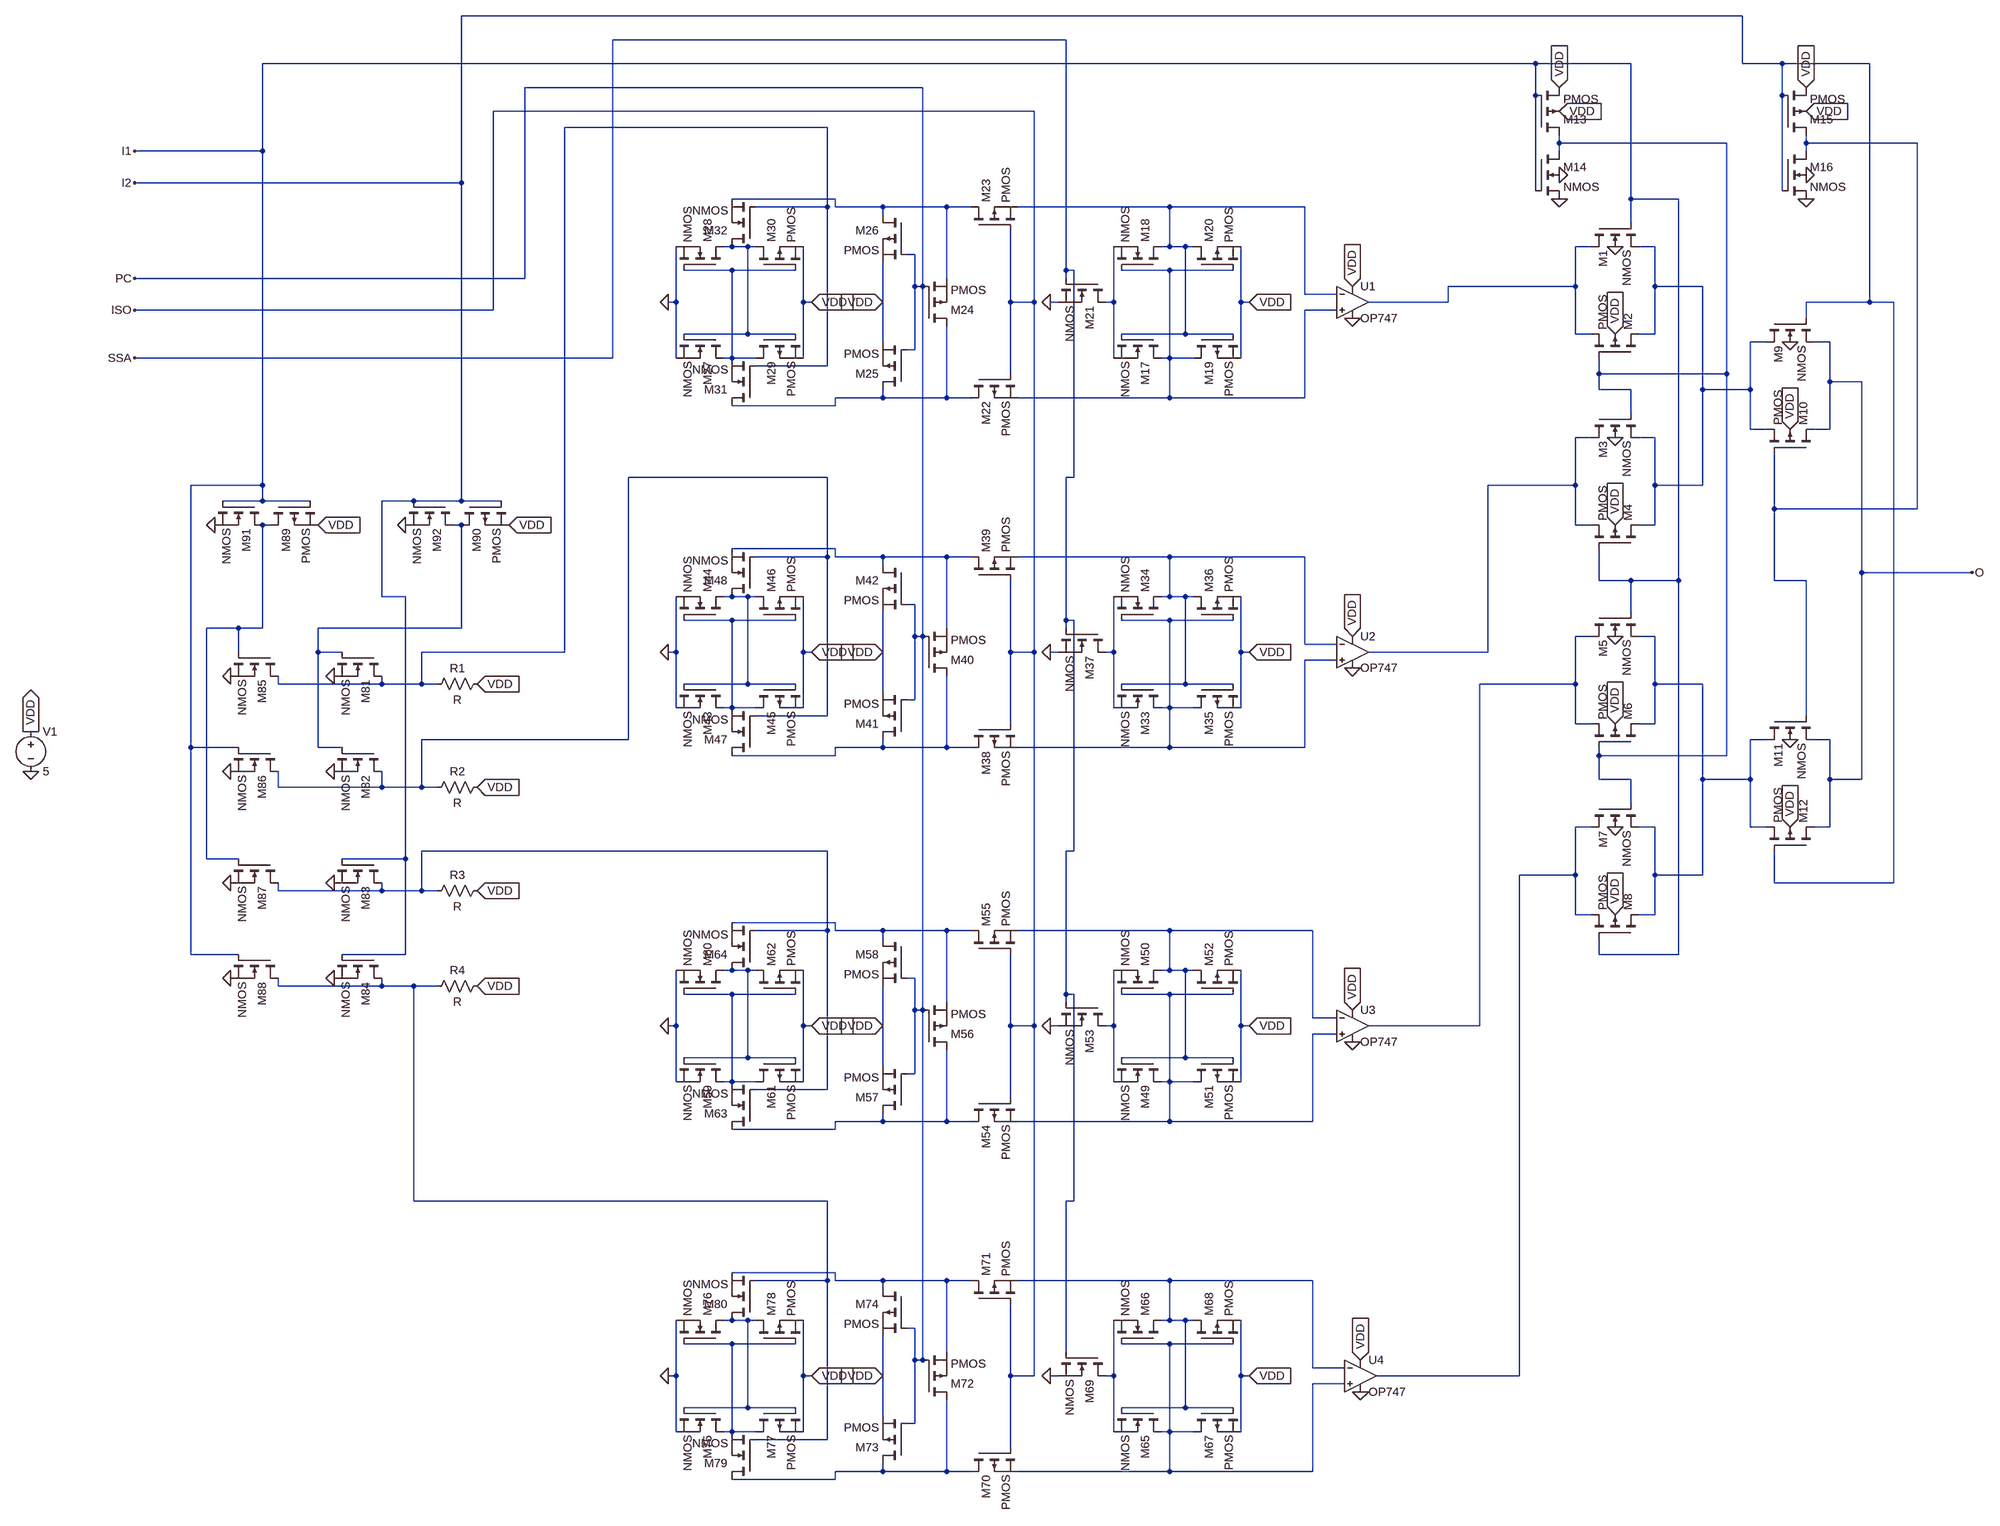
[diagram p0: schematic lut2.asc]
lut2.asc, the LTspice schematic file:
Version 4
SHEET 1 2856 2496
WIRE 768 -512 -1808 -512
WIRE -592 -464 -1504 -464
WIRE 352 -416 -2208 -416
WIRE 544 -416 352 -416
WIRE 768 -416 768 -512
WIRE 848 -416 768 -416
WIRE 1024 -416 848 -416
WIRE -880 -368 -1680 -368
WIRE 352 -352 352 -416
WIRE 848 -352 848 -416
WIRE -656 -320 -1744 -320
WIRE -1072 -288 -1600 -288
WIRE 400 -256 400 -272
WIRE 736 -256 400 -256
WIRE 896 -256 896 -272
WIRE 1120 -256 896 -256
WIRE -2208 -240 -2208 -416
WIRE -2208 -240 -2480 -240
WIRE 400 -240 400 -256
WIRE 896 -240 896 -256
WIRE -1808 -176 -1808 -512
WIRE -1808 -176 -2480 -176
WIRE 352 -160 352 -352
WIRE 848 -160 848 -352
WIRE -1056 -144 -1264 -144
WIRE 544 -144 544 -416
WIRE 640 -144 544 -144
WIRE -1072 -128 -1072 -288
WIRE -1072 -128 -1216 -128
WIRE -1056 -128 -1056 -144
WIRE -960 -128 -1056 -128
WIRE -832 -128 -960 -128
WIRE -784 -128 -832 -128
WIRE -384 -128 -688 -128
WIRE -112 -128 -384 -128
WIRE -960 -112 -960 -128
WIRE 544 -96 544 -144
WIRE -1264 -48 -1280 -48
WIRE -1232 -48 -1264 -48
WIRE -1216 -48 -1232 -48
WIRE -384 -48 -384 -128
WIRE -384 -48 -400 -48
WIRE -352 -48 -384 -48
WIRE -336 -48 -352 -48
WIRE 464 -48 432 -48
WIRE 592 -48 560 -48
WIRE -896 -32 -912 -32
WIRE -1264 0 -1360 0
WIRE -1136 0 -1264 0
WIRE -592 0 -592 -464
WIRE -576 0 -592 0
WIRE -384 0 -480 0
WIRE -256 0 -384 0
WIRE -1680 16 -1680 -368
WIRE -1680 16 -2480 16
WIRE -832 16 -832 -128
WIRE -592 16 -592 0
WIRE -896 32 -896 -32
WIRE -880 32 -880 -368
WIRE -880 32 -896 32
WIRE 432 32 432 -48
WIRE 432 32 176 32
WIRE 592 32 592 -48
WIRE 688 32 592 32
WIRE -112 48 -112 -128
WIRE -48 48 -112 48
WIRE -1376 64 -1376 -48
WIRE -1376 64 -1392 64
WIRE -1120 64 -1120 -48
WIRE -1104 64 -1120 64
WIRE -960 64 -960 -16
WIRE -704 64 -704 -80
WIRE -656 64 -656 -320
WIRE -656 64 -704 64
WIRE -608 64 -624 64
WIRE -496 64 -496 -48
WIRE -496 64 -512 64
WIRE -240 64 -240 -48
WIRE -224 64 -240 64
WIRE 176 64 176 32
WIRE 176 64 16 64
WIRE 1024 64 1024 -416
WIRE 1024 64 896 64
WIRE 1072 64 1024 64
WIRE -1744 80 -1744 -320
WIRE -1744 80 -2480 80
WIRE -48 80 -112 80
WIRE 896 96 896 64
WIRE -1232 128 -1232 -48
WIRE -1232 128 -1360 128
WIRE -1136 128 -1232 128
WIRE -352 128 -352 -48
WIRE -352 128 -480 128
WIRE -256 128 -352 128
WIRE 432 128 432 32
WIRE 464 128 432 128
WIRE 592 128 592 32
WIRE 592 128 560 128
WIRE -960 144 -960 64
WIRE 816 144 784 144
WIRE 944 144 912 144
WIRE -896 160 -896 32
WIRE -896 160 -912 160
WIRE -1504 176 -1504 -464
WIRE -1504 176 -2480 176
WIRE -1376 176 -1376 64
WIRE -1264 176 -1264 0
WIRE -1264 176 -1280 176
WIRE -1216 176 -1264 176
WIRE -1120 176 -1120 64
WIRE -496 176 -496 64
WIRE -384 176 -384 0
WIRE -384 176 -400 176
WIRE -336 176 -384 176
WIRE -240 176 -240 64
WIRE -1072 192 -1072 -128
WIRE -1072 192 -1216 192
WIRE -704 208 -704 64
WIRE 480 208 480 176
WIRE 736 208 736 -256
WIRE 736 208 480 208
WIRE 944 224 944 144
WIRE 1008 224 944 224
WIRE 480 240 480 208
WIRE 544 240 480 240
WIRE 688 240 688 32
WIRE 784 240 784 144
WIRE 784 240 688 240
WIRE -960 256 -960 240
WIRE -960 256 -1056 256
WIRE -832 256 -832 112
WIRE -832 256 -960 256
WIRE -784 256 -832 256
WIRE -384 256 -384 176
WIRE -384 256 -688 256
WIRE -112 256 -112 80
WIRE -112 256 -384 256
WIRE -1056 272 -1056 256
WIRE -1056 272 -1264 272
WIRE 544 288 544 240
WIRE 784 320 784 240
WIRE 816 320 784 320
WIRE 944 320 944 224
WIRE 944 320 912 320
WIRE 464 336 432 336
WIRE 592 336 560 336
WIRE -1072 416 -1472 416
WIRE -576 416 -576 0
WIRE -576 416 -592 416
WIRE -2208 432 -2208 -240
WIRE -2208 432 -2352 432
WIRE 432 432 432 336
WIRE 432 432 256 432
WIRE 592 432 592 336
WIRE 688 432 688 240
WIRE 688 432 592 432
WIRE -2208 464 -2208 432
WIRE -2208 464 -2288 464
WIRE -2112 464 -2208 464
WIRE -1904 464 -1968 464
WIRE -1808 464 -1808 -176
WIRE -1808 464 -1904 464
WIRE -1728 464 -1808 464
WIRE 832 480 832 368
WIRE 1120 480 1120 -256
WIRE 1120 480 832 480
WIRE -2192 512 -2208 512
WIRE -1808 512 -1824 512
WIRE 432 512 432 432
WIRE 464 512 432 512
WIRE 592 512 592 432
WIRE 592 512 560 512
WIRE -1056 560 -1264 560
WIRE -1072 576 -1072 416
WIRE -1072 576 -1216 576
WIRE -1056 576 -1056 560
WIRE -960 576 -1056 576
WIRE -832 576 -960 576
WIRE -784 576 -832 576
WIRE -384 576 -688 576
WIRE -112 576 -384 576
WIRE -960 592 -960 576
WIRE 1008 608 1008 224
WIRE 1248 608 1008 608
WIRE 480 624 480 560
WIRE 544 624 480 624
WIRE 640 624 640 -144
WIRE 640 624 544 624
WIRE 832 624 832 480
WIRE 896 624 832 624
WIRE -1968 656 -1968 464
WIRE -1920 656 -1968 656
WIRE -1264 656 -1280 656
WIRE -1232 656 -1264 656
WIRE -1216 656 -1232 656
WIRE -384 656 -384 576
WIRE -384 656 -400 656
WIRE -352 656 -384 656
WIRE -336 656 -352 656
WIRE -896 672 -912 672
WIRE 544 688 544 624
WIRE -1264 704 -1360 704
WIRE -1136 704 -1264 704
WIRE -592 704 -592 416
WIRE -576 704 -592 704
WIRE -384 704 -480 704
WIRE -256 704 -384 704
WIRE -2256 720 -2320 720
WIRE -2208 720 -2208 512
WIRE -2208 720 -2256 720
WIRE -1808 720 -1808 512
WIRE -1808 720 -2096 720
WIRE -832 720 -832 576
WIRE -592 720 -592 704
WIRE -896 736 -896 672
WIRE -880 736 -880 32
WIRE -880 736 -896 736
WIRE 464 736 432 736
WIRE 592 736 560 736
WIRE -112 752 -112 576
WIRE -48 752 -112 752
WIRE -2256 768 -2256 720
WIRE -2096 768 -2096 720
WIRE -2048 768 -2096 768
WIRE -1600 768 -1600 -288
WIRE -1600 768 -1888 768
WIRE -1376 768 -1376 656
WIRE -1376 768 -1392 768
WIRE -1120 768 -1120 656
WIRE -1104 768 -1120 768
WIRE -960 768 -960 688
WIRE -704 768 -704 624
WIRE -656 768 -656 64
WIRE -656 768 -704 768
WIRE -608 768 -624 768
WIRE -496 768 -496 656
WIRE -496 768 -512 768
WIRE -240 768 -240 656
WIRE -224 768 -240 768
WIRE 256 768 256 432
WIRE 256 768 16 768
WIRE -48 784 -112 784
WIRE -2176 832 -2176 816
WIRE -1968 832 -1968 816
WIRE -1968 832 -2176 832
WIRE -1888 832 -1888 768
WIRE -1888 832 -1968 832
WIRE -1856 832 -1888 832
WIRE -1232 832 -1232 656
WIRE -1232 832 -1360 832
WIRE -1136 832 -1232 832
WIRE -352 832 -352 656
WIRE -352 832 -480 832
WIRE -256 832 -352 832
WIRE 432 832 432 736
WIRE 432 832 240 832
WIRE 592 832 592 736
WIRE 688 832 592 832
WIRE -960 848 -960 768
WIRE -896 864 -896 736
WIRE -896 864 -912 864
WIRE -1376 880 -1376 768
WIRE -1264 880 -1264 704
WIRE -1264 880 -1280 880
WIRE -1216 880 -1264 880
WIRE -1120 880 -1120 768
WIRE -496 880 -496 768
WIRE -384 880 -384 704
WIRE -384 880 -400 880
WIRE -336 880 -384 880
WIRE -240 880 -240 768
WIRE -1072 896 -1072 576
WIRE -1072 896 -1216 896
WIRE 896 896 896 624
WIRE -704 912 -704 768
WIRE 432 912 432 832
WIRE 464 912 432 912
WIRE 592 912 592 832
WIRE 592 912 560 912
WIRE -1472 944 -1472 416
WIRE -1472 944 -1888 944
WIRE 816 944 784 944
WIRE 944 944 912 944
WIRE -2352 960 -2352 432
WIRE -2256 960 -2352 960
WIRE -2096 960 -2096 768
WIRE -2048 960 -2096 960
WIRE -960 960 -960 944
WIRE -960 960 -1056 960
WIRE -832 960 -832 816
WIRE -832 960 -960 960
WIRE -784 960 -832 960
WIRE -384 960 -384 880
WIRE -384 960 -688 960
WIRE -112 960 -112 784
WIRE -112 960 -384 960
WIRE -1056 976 -1056 960
WIRE -1056 976 -1264 976
WIRE 480 976 480 960
WIRE 736 976 736 208
WIRE 736 976 480 976
WIRE 480 1024 480 976
WIRE 544 1024 480 1024
WIRE 688 1024 688 832
WIRE 784 1024 784 944
WIRE 784 1024 688 1024
WIRE 944 1024 944 944
WIRE 1008 1024 1008 608
WIRE 1008 1024 944 1024
WIRE -2176 1040 -2176 1008
WIRE -1968 1040 -1968 1008
WIRE -1968 1040 -2176 1040
WIRE -1888 1040 -1888 944
WIRE -1888 1040 -1968 1040
WIRE -1856 1040 -1888 1040
WIRE 544 1072 544 1024
WIRE 464 1120 432 1120
WIRE 592 1120 560 1120
WIRE 784 1120 784 1024
WIRE 816 1120 784 1120
WIRE 944 1120 944 1024
WIRE 944 1120 912 1120
WIRE -1072 1168 -1888 1168
WIRE -576 1168 -576 704
WIRE -576 1168 -592 1168
WIRE -2320 1184 -2320 720
WIRE -2256 1184 -2320 1184
WIRE -1920 1184 -1920 656
WIRE -1920 1184 -2048 1184
WIRE 432 1216 432 1120
WIRE 432 1216 320 1216
WIRE 592 1216 592 1120
WIRE 688 1216 688 1024
WIRE 688 1216 592 1216
WIRE 832 1232 832 1168
WIRE 1072 1232 1072 64
WIRE 1072 1232 832 1232
WIRE -2176 1248 -2176 1232
WIRE -1968 1248 -1968 1232
WIRE -1968 1248 -2176 1248
WIRE -1888 1248 -1888 1168
WIRE -1888 1248 -1968 1248
WIRE -1856 1248 -1888 1248
WIRE 432 1296 432 1216
WIRE 464 1296 432 1296
WIRE 592 1296 592 1216
WIRE 592 1296 560 1296
WIRE -1056 1312 -1264 1312
WIRE -1072 1328 -1072 1168
WIRE -1072 1328 -1216 1328
WIRE -1056 1328 -1056 1312
WIRE -960 1328 -1056 1328
WIRE -832 1328 -960 1328
WIRE -784 1328 -832 1328
WIRE -384 1328 -688 1328
WIRE -96 1328 -384 1328
WIRE -960 1344 -960 1328
WIRE -2352 1376 -2352 960
WIRE -2256 1376 -2352 1376
WIRE -1920 1376 -1920 1184
WIRE -1920 1376 -2048 1376
WIRE 480 1376 480 1344
WIRE 640 1376 640 624
WIRE 640 1376 480 1376
WIRE -1264 1408 -1280 1408
WIRE -1232 1408 -1264 1408
WIRE -1216 1408 -1232 1408
WIRE -384 1408 -384 1328
WIRE -384 1408 -400 1408
WIRE -352 1408 -384 1408
WIRE -336 1408 -352 1408
WIRE -896 1424 -912 1424
WIRE -2176 1440 -2176 1424
WIRE -1968 1440 -1968 1424
WIRE -1968 1440 -2176 1440
WIRE -1904 1440 -1968 1440
WIRE -1856 1440 -1904 1440
WIRE -1264 1456 -1360 1456
WIRE -1136 1456 -1264 1456
WIRE -592 1456 -592 1168
WIRE -576 1456 -592 1456
WIRE -384 1456 -480 1456
WIRE -256 1456 -384 1456
WIRE -832 1472 -832 1328
WIRE -592 1472 -592 1456
WIRE -896 1488 -896 1424
WIRE -880 1488 -880 736
WIRE -880 1488 -896 1488
WIRE -96 1504 -96 1328
WIRE -48 1504 -96 1504
WIRE -1376 1520 -1376 1408
WIRE -1376 1520 -1392 1520
WIRE -1120 1520 -1120 1408
WIRE -1104 1520 -1120 1520
WIRE -960 1520 -960 1440
WIRE -704 1520 -704 1376
WIRE -656 1520 -656 768
WIRE -656 1520 -704 1520
WIRE -608 1520 -624 1520
WIRE -496 1520 -496 1408
WIRE -496 1520 -512 1520
WIRE -240 1520 -240 1408
WIRE -224 1520 -240 1520
WIRE 240 1520 240 832
WIRE 240 1520 16 1520
WIRE -48 1536 -96 1536
WIRE -1232 1584 -1232 1408
WIRE -1232 1584 -1360 1584
WIRE -1136 1584 -1232 1584
WIRE -352 1584 -352 1408
WIRE -352 1584 -480 1584
WIRE -256 1584 -352 1584
WIRE -960 1600 -960 1520
WIRE -896 1616 -896 1488
WIRE -896 1616 -912 1616
WIRE -1376 1632 -1376 1520
WIRE -1264 1632 -1264 1456
WIRE -1264 1632 -1280 1632
WIRE -1216 1632 -1264 1632
WIRE -1120 1632 -1120 1520
WIRE -496 1632 -496 1520
WIRE -384 1632 -384 1456
WIRE -384 1632 -400 1632
WIRE -336 1632 -384 1632
WIRE -240 1632 -240 1520
WIRE -1072 1648 -1072 1328
WIRE -1072 1648 -1216 1648
WIRE -704 1664 -704 1520
WIRE -960 1712 -960 1696
WIRE -960 1712 -1056 1712
WIRE -832 1712 -832 1568
WIRE -832 1712 -960 1712
WIRE -784 1712 -832 1712
WIRE -384 1712 -384 1632
WIRE -384 1712 -688 1712
WIRE -96 1712 -96 1536
WIRE -96 1712 -384 1712
WIRE -1056 1728 -1056 1712
WIRE -1056 1728 -1264 1728
WIRE -1904 1872 -1904 1440
WIRE -1072 1872 -1904 1872
WIRE -576 1872 -576 1456
WIRE -576 1872 -592 1872
WIRE -1056 2016 -1264 2016
WIRE -1072 2032 -1072 1872
WIRE -1072 2032 -1216 2032
WIRE -1056 2032 -1056 2016
WIRE -960 2032 -1056 2032
WIRE -832 2032 -960 2032
WIRE -784 2032 -832 2032
WIRE -384 2032 -688 2032
WIRE -96 2032 -384 2032
WIRE -960 2048 -960 2032
WIRE -1264 2112 -1280 2112
WIRE -1232 2112 -1264 2112
WIRE -1216 2112 -1232 2112
WIRE -384 2112 -384 2032
WIRE -384 2112 -400 2112
WIRE -352 2112 -384 2112
WIRE -336 2112 -352 2112
WIRE -896 2128 -912 2128
WIRE -1264 2160 -1360 2160
WIRE -1136 2160 -1264 2160
WIRE -384 2160 -480 2160
WIRE -256 2160 -384 2160
WIRE -832 2176 -832 2032
WIRE -592 2176 -592 1872
WIRE -896 2192 -896 2128
WIRE -880 2192 -880 1488
WIRE -880 2192 -896 2192
WIRE -96 2208 -96 2032
WIRE -32 2208 -96 2208
WIRE -1376 2224 -1376 2112
WIRE -1376 2224 -1392 2224
WIRE -1120 2224 -1120 2112
WIRE -1104 2224 -1120 2224
WIRE -960 2224 -960 2144
WIRE -704 2224 -704 2080
WIRE -656 2224 -656 1520
WIRE -656 2224 -704 2224
WIRE -608 2224 -624 2224
WIRE -496 2224 -496 2112
WIRE -496 2224 -512 2224
WIRE -240 2224 -240 2112
WIRE -224 2224 -240 2224
WIRE 320 2224 320 1216
WIRE 320 2224 32 2224
WIRE -32 2240 -96 2240
WIRE -1232 2288 -1232 2112
WIRE -1232 2288 -1360 2288
WIRE -1136 2288 -1232 2288
WIRE -352 2288 -352 2112
WIRE -352 2288 -480 2288
WIRE -256 2288 -352 2288
WIRE -960 2304 -960 2224
WIRE -896 2320 -896 2192
WIRE -896 2320 -912 2320
WIRE -1376 2336 -1376 2224
WIRE -1264 2336 -1264 2160
WIRE -1264 2336 -1280 2336
WIRE -1216 2336 -1264 2336
WIRE -1120 2336 -1120 2224
WIRE -496 2336 -496 2224
WIRE -384 2336 -384 2160
WIRE -384 2336 -400 2336
WIRE -336 2336 -384 2336
WIRE -240 2336 -240 2224
WIRE -1072 2352 -1072 2032
WIRE -1072 2352 -1216 2352
WIRE -704 2368 -704 2224
WIRE -960 2416 -960 2400
WIRE -960 2416 -1056 2416
WIRE -832 2416 -832 2272
WIRE -832 2416 -960 2416
WIRE -784 2416 -832 2416
WIRE -384 2416 -384 2336
WIRE -384 2416 -688 2416
WIRE -96 2416 -96 2240
WIRE -96 2416 -384 2416
WIRE -1056 2432 -1056 2416
WIRE -1056 2432 -1264 2432
FLAG 512 -48 0
FLAG 512 128 VDD
IOPIN 512 128 In
FLAG 512 336 0
FLAG 512 512 VDD
IOPIN 512 512 In
FLAG 512 736 0
FLAG 512 912 VDD
IOPIN 512 912 In
FLAG 512 1120 0
FLAG 512 1296 VDD
IOPIN 512 1296 In
FLAG 864 144 0
FLAG 864 320 VDD
IOPIN 864 320 In
FLAG 864 944 0
FLAG 864 1120 VDD
IOPIN 864 1120 In
FLAG 400 -368 VDD
IOPIN 400 -368 In
FLAG 400 -144 0
FLAG 896 -368 VDD
IOPIN 896 -368 In
FLAG 896 -144 0
FLAG 400 -320 VDD
IOPIN 400 -320 In
FLAG 896 -320 VDD
IOPIN 896 -320 In
FLAG 896 -192 0
FLAG 400 -192 0
FLAG -2992 1008 0
FLAG -2992 928 VDD
IOPIN -2992 928 Out
FLAG -224 64 VDD
IOPIN -224 64 In
FLAG -624 64 0
FLAG -960 64 VDD
IOPIN -960 64 In
FLAG -2480 176 SSA
FLAG -2480 80 ISO
FLAG -2480 16 PC
FLAG -1104 64 VDD
IOPIN -1104 64 In
FLAG -1392 64 0
FLAG -224 768 VDD
IOPIN -224 768 In
FLAG -624 768 0
FLAG -960 768 VDD
IOPIN -960 768 In
FLAG -1104 768 VDD
IOPIN -1104 768 In
FLAG -1392 768 0
FLAG -224 1520 VDD
IOPIN -224 1520 In
FLAG -624 1520 0
FLAG -960 1520 VDD
IOPIN -960 1520 In
FLAG -1104 1520 VDD
IOPIN -1104 1520 In
FLAG -1392 1520 0
FLAG -224 2224 VDD
IOPIN -224 2224 In
FLAG -624 2224 0
FLAG -960 2224 VDD
IOPIN -960 2224 In
FLAG -1104 2224 VDD
IOPIN -1104 2224 In
FLAG -1392 2224 0
FLAG 0 2192 VDD
IOPIN 0 2192 In
FLAG 0 2256 0
FLAG -16 1488 VDD
IOPIN -16 1488 In
FLAG -16 1552 0
FLAG -16 736 VDD
IOPIN -16 736 In
FLAG -16 800 0
FLAG -16 32 VDD
IOPIN -16 32 In
FLAG -16 96 0
FLAG -2064 816 0
FLAG -2064 1008 0
FLAG -2064 1232 0
FLAG -2064 1424 0
FLAG -2272 1424 0
FLAG -2272 1232 0
FLAG -2272 1008 0
FLAG -2272 816 0
FLAG -1776 832 VDD
IOPIN -1776 832 In
FLAG -1776 1040 VDD
IOPIN -1776 1040 In
FLAG -1776 1248 VDD
IOPIN -1776 1248 In
FLAG -1776 1440 VDD
IOPIN -1776 1440 In
FLAG -2096 512 VDD
IOPIN -2096 512 In
FLAG -1712 512 VDD
IOPIN -1712 512 In
FLAG -2304 512 0
FLAG -1920 512 0
FLAG -2480 -240 I1
FLAG -2480 -176 I2
FLAG 1248 608 O
SYMBOL nmos4 464 -96 M90
WINDOW 0 56 25 Left 2
SYMATTR InstName M1
SYMBOL pmos4 560 176 M270
WINDOW 0 56 21 Left 2
SYMATTR InstName M2
SYMBOL nmos4 464 288 M90
WINDOW 0 56 25 Left 2
SYMATTR InstName M3
SYMBOL pmos4 560 560 M270
WINDOW 0 56 21 Left 2
SYMATTR InstName M4
SYMBOL nmos4 464 688 M90
WINDOW 0 56 25 Left 2
SYMATTR InstName M5
SYMBOL pmos4 560 960 M270
WINDOW 0 56 21 Left 2
SYMATTR InstName M6
SYMBOL nmos4 464 1072 M90
WINDOW 0 56 25 Left 2
SYMATTR InstName M7
SYMBOL pmos4 560 1344 M270
WINDOW 0 56 21 Left 2
SYMATTR InstName M8
SYMBOL nmos4 816 96 M90
WINDOW 0 56 25 Left 2
SYMATTR InstName M9
SYMBOL pmos4 912 368 M270
WINDOW 0 56 21 Left 2
SYMATTR InstName M10
SYMBOL nmos4 816 896 M90
WINDOW 0 56 25 Left 2
SYMATTR InstName M11
SYMBOL pmos4 912 1168 M270
WINDOW 0 56 21 Left 2
SYMATTR InstName M12
SYMBOL pmos4 352 -272 M180
SYMATTR InstName M13
SYMBOL nmos4 352 -240 R0
SYMATTR InstName M14
SYMBOL pmos4 848 -272 M180
SYMATTR InstName M15
SYMBOL nmos4 848 -240 R0
SYMATTR InstName M16
SYMBOL voltage -2992 912 R0
WINDOW 123 0 0 Left 0
WINDOW 39 0 0 Left 0
SYMATTR InstName V1
SYMATTR Value 5
SYMBOL nmos -400 128 R90
SYMATTR InstName M17
SYMBOL nmos -400 0 M270
SYMATTR InstName M18
SYMBOL pmos -336 128 M90
SYMATTR InstName M19
SYMBOL pmos -336 0 R270
SYMATTR InstName M20
SYMBOL nmos -512 16 R90
SYMATTR InstName M21
SYMBOL pmos -784 208 M90
SYMATTR InstName M22
SYMBOL pmos -784 -80 R270
SYMATTR InstName M23
SYMBOL pmos -880 112 M180
SYMATTR InstName M24
SYMBOL pmos -912 240 R180
SYMATTR InstName M25
SYMBOL pmos -912 -112 M0
SYMATTR InstName M26
SYMBOL nmos -1280 128 R90
SYMATTR InstName M27
SYMBOL nmos -1280 0 M270
SYMATTR InstName M28
SYMBOL pmos -1216 128 M90
SYMATTR InstName M29
SYMBOL pmos -1216 0 R270
SYMATTR InstName M30
SYMBOL nmos -1216 272 R180
SYMATTR InstName M31
SYMBOL nmos -1216 -48 R180
SYMATTR InstName M32
SYMBOL nmos -400 832 R90
SYMATTR InstName M33
SYMBOL nmos -400 704 M270
SYMATTR InstName M34
SYMBOL pmos -336 832 M90
SYMATTR InstName M35
SYMBOL pmos -336 704 R270
SYMATTR InstName M36
SYMBOL nmos -512 720 R90
SYMATTR InstName M37
SYMBOL pmos -784 912 M90
SYMATTR InstName M38
SYMBOL pmos -784 624 R270
SYMATTR InstName M39
SYMBOL pmos -880 816 M180
SYMATTR InstName M40
SYMBOL pmos -912 944 R180
SYMATTR InstName M41
SYMBOL pmos -912 592 M0
SYMATTR InstName M42
SYMBOL nmos -1280 832 R90
SYMATTR InstName M43
SYMBOL nmos -1280 704 M270
SYMATTR InstName M44
SYMBOL pmos -1216 832 M90
SYMATTR InstName M45
SYMBOL pmos -1216 704 R270
SYMATTR InstName M46
SYMBOL nmos -1216 976 R180
SYMATTR InstName M47
SYMBOL nmos -1216 656 R180
SYMATTR InstName M48
SYMBOL nmos -400 1584 R90
SYMATTR InstName M49
SYMBOL nmos -400 1456 M270
SYMATTR InstName M50
SYMBOL pmos -336 1584 M90
SYMATTR InstName M51
SYMBOL pmos -336 1456 R270
SYMATTR InstName M52
SYMBOL nmos -512 1472 R90
SYMATTR InstName M53
SYMBOL pmos -784 1664 M90
SYMATTR InstName M54
SYMBOL pmos -784 1376 R270
SYMATTR InstName M55
SYMBOL pmos -880 1568 M180
SYMATTR InstName M56
SYMBOL pmos -912 1696 R180
SYMATTR InstName M57
SYMBOL pmos -912 1344 M0
SYMATTR InstName M58
SYMBOL nmos -1280 1584 R90
SYMATTR InstName M59
SYMBOL nmos -1280 1456 M270
SYMATTR InstName M60
SYMBOL pmos -1216 1584 M90
SYMATTR InstName M61
SYMBOL pmos -1216 1456 R270
SYMATTR InstName M62
SYMBOL nmos -1216 1728 R180
SYMATTR InstName M63
SYMBOL nmos -1216 1408 R180
SYMATTR InstName M64
SYMBOL nmos -400 2288 R90
SYMATTR InstName M65
SYMBOL nmos -400 2160 M270
SYMATTR InstName M66
SYMBOL pmos -336 2288 M90
SYMATTR InstName M67
SYMBOL pmos -336 2160 R270
SYMATTR InstName M68
SYMBOL nmos -512 2176 R90
SYMATTR InstName M69
SYMBOL pmos -784 2368 M90
SYMATTR InstName M70
SYMBOL pmos -784 2080 R270
SYMATTR InstName M71
SYMBOL pmos -880 2272 M180
SYMATTR InstName M72
SYMBOL pmos -912 2400 R180
SYMATTR InstName M73
SYMBOL pmos -912 2048 M0
SYMATTR InstName M74
SYMBOL nmos -1280 2288 R90
SYMATTR InstName M75
SYMBOL nmos -1280 2160 M270
SYMATTR InstName M76
SYMBOL pmos -1216 2288 M90
SYMATTR InstName M77
SYMBOL pmos -1216 2160 R270
SYMATTR InstName M78
SYMBOL nmos -1216 2432 R180
SYMATTR InstName M79
SYMBOL nmos -1216 2112 R180
SYMATTR InstName M80
SYMBOL OpAmps\\OP747 -16 0 R0
SYMATTR InstName U1
SYMBOL OpAmps\\OP747 -16 704 R0
SYMATTR InstName U2
SYMBOL OpAmps\\OP747 -16 1456 R0
SYMATTR InstName U3
SYMBOL OpAmps\\OP747 0 2160 R0
SYMATTR InstName U4
SYMBOL nmos -1968 768 R90
SYMATTR InstName M81
SYMBOL nmos -1968 960 R90
SYMATTR InstName M82
SYMBOL res -1760 816 R90
WINDOW 0 0 56 VBottom 2
WINDOW 3 32 56 VTop 2
SYMATTR InstName R1
SYMBOL res -1760 1024 R90
WINDOW 0 0 56 VBottom 2
WINDOW 3 32 56 VTop 2
SYMATTR InstName R2
SYMBOL res -1760 1232 R90
WINDOW 0 0 56 VBottom 2
WINDOW 3 32 56 VTop 2
SYMATTR InstName R3
SYMBOL res -1760 1424 R90
WINDOW 0 0 56 VBottom 2
WINDOW 3 32 56 VTop 2
SYMATTR InstName R4
SYMBOL nmos -1968 1184 R90
SYMATTR InstName M83
SYMBOL nmos -1968 1376 R90
SYMATTR InstName M84
SYMBOL nmos -2176 768 R90
SYMATTR InstName M85
SYMBOL nmos -2176 960 R90
SYMATTR InstName M86
SYMBOL nmos -2176 1184 R90
SYMATTR InstName M87
SYMBOL nmos -2176 1376 R90
SYMATTR InstName M88
SYMBOL pmos -2192 464 M90
SYMATTR InstName M89
SYMBOL pmos -1808 464 M90
SYMATTR InstName M90
SYMBOL nmos -2208 464 R90
SYMATTR InstName M91
SYMBOL nmos -1824 464 R90
SYMATTR InstName M92

The netlist it stands for:
* lut2.asc
M1 N007 I1 N008 0 NMOS
M2 N008 N002 N007 VDD PMOS
M3 N013 N002 N008 0 NMOS
M4 N008 I1 N013 VDD PMOS
M5 N022 I1 N023 0 NMOS
M6 N023 N002 N022 VDD PMOS
M7 N026 N002 N023 0 NMOS
M8 N023 I1 N026 VDD PMOS
M9 N008 I2 O 0 NMOS
M10 O N003 N008 VDD PMOS
M11 N023 N003 O 0 NMOS
M12 O I2 N023 VDD PMOS
M13 N002 I1 VDD VDD PMOS
M14 N002 I1 0 0 NMOS
M15 N003 I2 VDD VDD PMOS
M16 N003 I2 0 0 NMOS
V1 VDD 0 5
M17 N010 N005 N011 N011 NMOS
M18 N005 N010 N011 N011 NMOS
M19 N010 N005 VDD VDD PMOS
M20 N005 N010 VDD VDD PMOS
M21 N011 SSA 0 0 NMOS
M22 N012 ISO N010 N010 PMOS
M23 N004 ISO N005 N005 PMOS
M24 N012 PC N004 N004 PMOS
M25 N012 PC VDD VDD PMOS
M26 N004 PC VDD VDD PMOS
M27 N009 N006 0 0 NMOS
M28 N006 N009 0 0 NMOS
M29 N009 N006 VDD VDD PMOS
M30 N006 N009 VDD VDD PMOS
M31 N012 N001 N009 N009 NMOS
M32 N006 N001 N004 N004 NMOS
M33 N021 N018 N024 N024 NMOS
M34 N018 N021 N024 N024 NMOS
M35 N021 N018 VDD VDD PMOS
M36 N018 N021 VDD VDD PMOS
M37 N024 SSA 0 0 NMOS
M38 N025 ISO N021 N021 PMOS
M39 N017 ISO N018 N018 PMOS
M40 N025 PC N017 N017 PMOS
M41 N025 PC VDD VDD PMOS
M42 N017 PC VDD VDD PMOS
M43 N020 N019 0 0 NMOS
M44 N019 N020 0 0 NMOS
M45 N020 N019 VDD VDD PMOS
M46 N019 N020 VDD VDD PMOS
M47 N025 N014 N020 N020 NMOS
M48 N019 N014 N017 N017 NMOS
M49 N033 N029 N034 N034 NMOS
M50 N029 N033 N034 N034 NMOS
M51 N033 N029 VDD VDD PMOS
M52 N029 N033 VDD VDD PMOS
M53 N034 SSA 0 0 NMOS
M54 N035 ISO N033 N033 PMOS
M55 N028 ISO N029 N029 PMOS
M56 N035 PC N028 N028 PMOS
M57 N035 PC VDD VDD PMOS
M58 N028 PC VDD VDD PMOS
M59 N032 N030 0 0 NMOS
M60 N030 N032 0 0 NMOS
M61 N032 N030 VDD VDD PMOS
M62 N030 N032 VDD VDD PMOS
M63 N035 N027 N032 N032 NMOS
M64 N030 N027 N028 N028 NMOS
M65 N040 N037 N041 N041 NMOS
M66 N037 N040 N041 N041 NMOS
M67 N040 N037 VDD VDD PMOS
M68 N037 N040 VDD VDD PMOS
M69 N041 SSA 0 0 NMOS
M70 N042 ISO N040 N040 PMOS
M71 N036 ISO N037 N037 PMOS
M72 N042 PC N036 N036 PMOS
M73 N042 PC VDD VDD PMOS
M74 N036 PC VDD VDD PMOS
M75 N039 N038 0 0 NMOS
M76 N038 N039 0 0 NMOS
M77 N039 N038 VDD VDD PMOS
M78 N038 N039 VDD VDD PMOS
M79 N042 N031 N039 N039 NMOS
M80 N038 N031 N036 N036 NMOS
XU1 N010 N005 VDD 0 N007 OP747  ; pins In+ In- V+ V- OUT
XU2 N021 N018 VDD 0 N013 OP747  ; pins In+ In- V+ V- OUT
XU3 N033 N029 VDD 0 N022 OP747  ; pins In+ In- V+ V- OUT
XU4 N040 N037 VDD 0 N026 OP747  ; pins In+ In- V+ V- OUT
M81 N001 N016 0 0 NMOS
M82 N014 N016 0 0 NMOS
R1 VDD N001 R
R2 VDD N014 R
R3 VDD N027 R
R4 VDD N031 R
M83 N027 I2 0 0 NMOS
M84 N031 I2 0 0 NMOS
M85 N001 N015 0 0 NMOS
M86 N014 I1 0 0 NMOS
M87 N027 N015 0 0 NMOS
M88 N031 I1 0 0 NMOS
M89 N015 I1 VDD VDD PMOS
M90 N016 I2 VDD VDD PMOS
M91 N015 I1 0 0 NMOS
M92 N016 I2 0 0 NMOS
.model NMOS NMOS
.model PMOS PMOS
.lib standard.mos
.backanno
.end